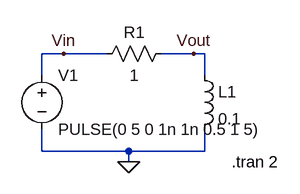
[diagram p0: schematic rlckt.asc]
rlckt.asc, the LTspice schematic file:
Version 4.1
SHEET 1 880 680
WIRE 64 80 32 80
WIRE 128 80 64 80
WIRE 256 80 208 80
WIRE 272 80 256 80
WIRE 32 112 32 80
WIRE 272 112 272 80
WIRE 32 224 32 192
WIRE 160 224 32 224
WIRE 272 224 272 192
WIRE 272 224 160 224
WIRE 160 240 160 224
FLAG 160 240 0
FLAG 64 80 Vin
FLAG 256 80 Vout
SYMBOL res 224 64 R90
WINDOW 0 0 56 VBottom 2
WINDOW 3 32 56 VTop 2
SYMATTR InstName R1
SYMATTR Value 1
SYMBOL ind 256 96 R0
SYMATTR InstName L1
SYMATTR Value 0.1
SYMBOL voltage 32 96 R0
WINDOW 123 0 0 Left 0
WINDOW 39 0 0 Left 0
SYMATTR InstName V1
SYMATTR Value PULSE(0 5 0 1n 1n 0.5 1 5)
TEXT 312 240 Left 2 !.tran 2

The netlist it stands for:
* rlckt.asc
R1 Vout Vin 1
L1 Vout 0 0.1
V1 Vin 0 PULSE(0 5 0 1n 1n 0.5 1 5)
.tran 2
.backanno
.end